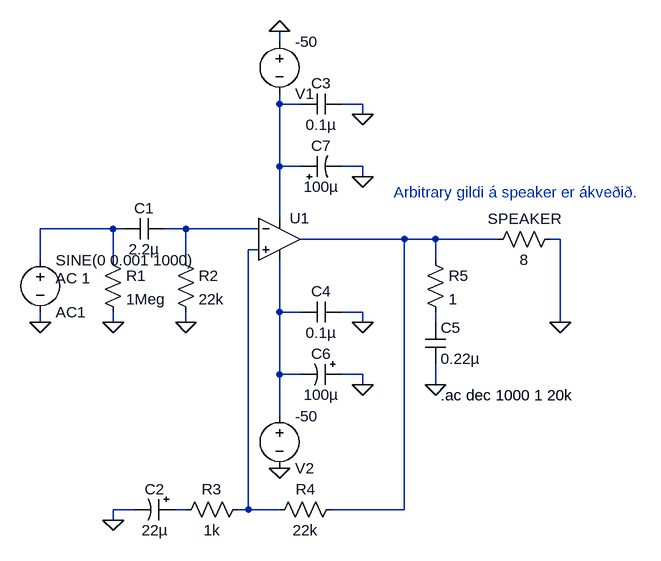
[diagram p0: schematic StorRasVers1_22uF.asc]
StorRasVers1_22uF.asc, the LTspice schematic file:
Version 4
SHEET 1 880 680
WIRE -144 -112 -144 -128
WIRE -144 -16 -144 -32
WIRE -112 -16 -144 -16
WIRE -16 -16 -48 -16
WIRE -16 0 -16 -16
WIRE -144 80 -144 -16
WIRE -112 80 -144 80
WIRE -16 80 -48 80
WIRE -16 96 -16 80
WIRE -144 160 -144 80
WIRE -400 176 -512 176
WIRE -384 176 -400 176
WIRE -288 176 -320 176
WIRE -176 176 -288 176
WIRE 48 192 -112 192
WIRE 96 192 48 192
WIRE 192 192 96 192
WIRE 288 192 272 192
WIRE -176 208 -192 208
WIRE -512 224 -512 176
WIRE -400 224 -400 176
WIRE -288 224 -288 176
WIRE 96 224 96 192
WIRE -144 304 -144 224
WIRE -112 304 -144 304
WIRE -16 304 -48 304
WIRE -512 320 -512 304
WIRE -400 320 -400 304
WIRE -288 320 -288 304
WIRE -16 320 -16 304
WIRE 96 320 96 304
WIRE 288 320 288 192
WIRE -144 400 -144 304
WIRE -112 400 -144 400
WIRE -16 400 -48 400
WIRE -16 416 -16 400
WIRE 96 416 96 384
WIRE -144 464 -144 400
WIRE -368 608 -400 608
WIRE -288 608 -304 608
WIRE -192 608 -192 208
WIRE -192 608 -208 608
WIRE -144 608 -192 608
WIRE 48 608 48 192
WIRE 48 608 -64 608
WIRE -400 624 -400 608
FLAG -512 320 0
FLAG -400 320 0
FLAG -288 320 0
FLAG -16 96 0
FLAG -16 0 0
FLAG -16 320 0
FLAG -16 416 0
FLAG -400 624 0
FLAG 96 416 0
FLAG 288 320 0
FLAG -144 544 0
FLAG -144 -128 0
SYMBOL OpAmps\\UniversalOpAmp2 -144 192 R0
SYMATTR InstName U1
SYMBOL res -416 208 R0
SYMATTR InstName R1
SYMATTR Value 1Meg
SYMBOL res -304 208 R0
SYMATTR InstName R2
SYMATTR Value 22k
SYMBOL cap -320 160 R90
WINDOW 0 0 32 VBottom 2
WINDOW 3 32 32 VTop 2
SYMATTR InstName C1
SYMATTR Value 2.2µ
SYMBOL polcap -112 96 R270
WINDOW 0 32 32 VTop 2
WINDOW 3 0 32 VBottom 2
SYMATTR InstName C7
SYMATTR Value 100µ
SYMBOL polcap -48 384 R90
WINDOW 0 0 32 VBottom 2
WINDOW 3 32 32 VTop 2
SYMATTR InstName C6
SYMATTR Value 100µ
SYMBOL cap -48 -32 R90
WINDOW 0 0 32 VBottom 2
WINDOW 3 32 32 VTop 2
SYMATTR InstName C3
SYMATTR Value 0.1µ
SYMBOL cap -48 288 R90
WINDOW 0 0 32 VBottom 2
WINDOW 3 32 32 VTop 2
SYMATTR InstName C4
SYMATTR Value 0.1µ
SYMBOL res -48 592 R90
WINDOW 0 0 56 VBottom 2
WINDOW 3 32 56 VTop 2
SYMATTR InstName R4
SYMATTR Value 22k
SYMBOL res -192 592 R90
WINDOW 0 0 56 VBottom 2
WINDOW 3 32 56 VTop 2
SYMATTR InstName R3
SYMATTR Value 1k
SYMBOL polcap -304 592 R90
WINDOW 0 0 32 VBottom 2
WINDOW 3 32 32 VTop 2
SYMATTR InstName C2
SYMATTR Value 22µ
SYMBOL res 80 208 R0
SYMATTR InstName R5
SYMATTR Value 1
SYMBOL res 288 176 R90
WINDOW 0 0 56 VBottom 2
WINDOW 3 32 56 VTop 2
SYMATTR InstName SPEAKER
SYMATTR Value 8
SYMBOL cap 80 320 R0
SYMATTR InstName C5
SYMATTR Value 0.22µ
SYMBOL voltage -144 -128 R0
WINDOW 0 24 96 Left 2
WINDOW 3 24 16 Left 2
WINDOW 123 0 0 Left 0
WINDOW 39 0 0 Left 0
SYMATTR InstName V1
SYMATTR Value -50
SYMBOL voltage -144 448 R0
WINDOW 0 24 96 Left 2
WINDOW 3 24 16 Left 2
WINDOW 123 0 0 Left 0
WINDOW 39 0 0 Left 0
SYMATTR InstName V2
SYMATTR Value -50
SYMBOL voltage -512 208 R0
WINDOW 0 24 96 Left 2
WINDOW 3 24 16 Left 2
WINDOW 123 24 44 Left 2
WINDOW 39 0 0 Left 0
SYMATTR InstName AC1
SYMATTR Value SINE(0 0.001 1000)
SYMATTR Value2 AC 1
TEXT 32 120 Left 2 ;Arbitrary gildi á speaker er ákveðið.
TEXT 104 432 Left 2 !.ac dec 1000 1 20k

The netlist it stands for:
* StorRasVers1_22uF.asc
XU1 N005 N003 N001 N006 N004 level2 Avol=1Meg GBW=10Meg Slew=10Meg Ilimit=25m Rail=0 Vos=0 En=0 Enk=0 In=0 Ink=0 Rin=500Meg  ; pins In+ In- V+ V- OUT
R1 N002 0 1Meg
R2 N003 0 22k
C1 N003 N002 2.2µ
C7 N001 0 100µ
C6 0 N006 100µ
C3 0 N001 0.1µ
C4 0 N006 0.1µ
R4 N004 N005 22k
R3 N005 N008 1k
C2 N008 0 22µ
R5 N004 N007 1
R§SPEAKER 0 N004 8
C5 N007 0 0.22µ
V1 0 N001 -50
V2 N006 0 -50
V§AC1 N002 0 SINE(0 0.001 1000) AC 1
* Arbitrary gildi á speaker er ákveðið.
.ac dec 1000 1 20k
.lib UniversalOpAmp2.lib
.backanno
.end